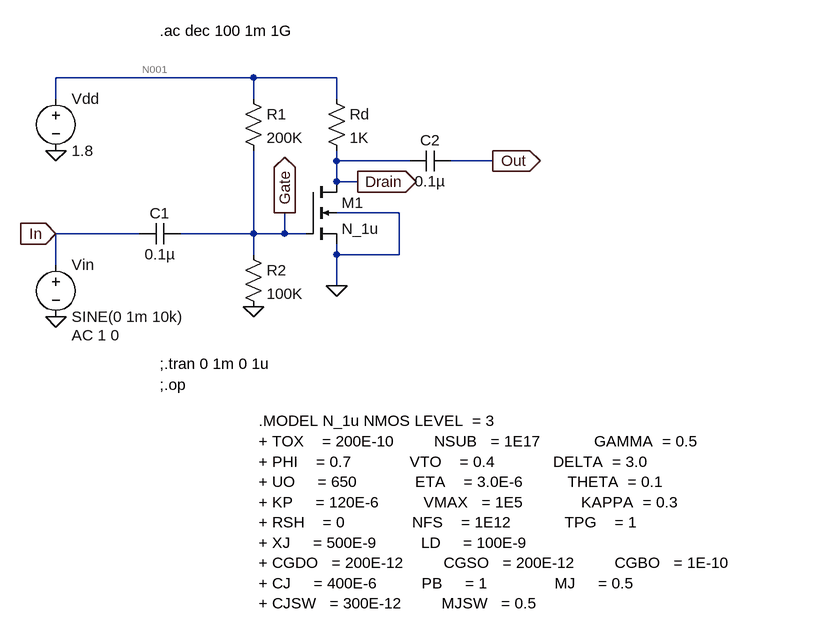
[diagram p0: schematic CS Amp.asc]
CS Amp.asc, the LTspice schematic file:
Version 4
SHEET 1 880 732
WIRE 0 -64 -304 -64
WIRE 128 -64 0 -64
WIRE -304 -32 -304 -64
WIRE 0 -32 0 -64
WIRE 128 -32 128 -64
WIRE 128 64 128 48
WIRE 240 64 128 64
WIRE 368 64 304 64
WIRE 128 96 128 64
WIRE 160 96 128 96
WIRE 224 144 128 144
WIRE -176 176 -304 176
WIRE 0 176 0 48
WIRE 0 176 -112 176
WIRE 48 176 48 144
WIRE 48 176 0 176
WIRE 80 176 48 176
WIRE 0 208 0 176
WIRE 128 208 128 192
WIRE 224 208 224 144
WIRE 224 208 128 208
WIRE -304 224 -304 176
WIRE 128 256 128 208
FLAG 0 288 0
FLAG -304 48 0
FLAG -304 304 0
FLAG 368 64 Out
IOPIN 368 64 Out
FLAG 160 96 Drain
IOPIN 160 96 Out
FLAG 48 144 Gate
IOPIN 48 144 Out
FLAG 128 256 0
FLAG -304 176 In
IOPIN -304 176 In
SYMBOL res 112 -48 R0
SYMATTR InstName Rd
SYMATTR Value 1K
SYMBOL nmos4 80 96 R0
SYMATTR InstName M1
SYMATTR Value N_1u
SYMATTR Value2 l=1u w=416u
SYMBOL res -16 -48 R0
SYMATTR InstName R1
SYMATTR Value 200K
SYMBOL res -16 192 R0
SYMATTR InstName R2
SYMATTR Value 100K
SYMBOL voltage -304 208 R0
WINDOW 123 24 124 Left 2
WINDOW 39 0 0 Left 0
SYMATTR Value2 AC 1 0
SYMATTR InstName Vin
SYMATTR Value SINE(0 1m 10k)
SYMBOL voltage -304 -48 R0
WINDOW 123 0 0 Left 0
WINDOW 39 0 0 Left 0
SYMATTR InstName Vdd
SYMATTR Value 1.8
SYMBOL cap 304 48 R90
WINDOW 0 0 32 VBottom 2
WINDOW 3 32 32 VTop 2
SYMATTR InstName C2
SYMATTR Value 0.1µ
SYMBOL cap -112 160 R90
WINDOW 0 0 32 VBottom 2
WINDOW 3 32 32 VTop 2
SYMATTR InstName C1
SYMATTR Value 0.1µ
TEXT -144 408 Left 2 !;.op
TEXT -144 376 Left 2 !;.tran 0 1m 0 1u
TEXT -144 -136 Left 2 !.ac dec 100 1m 1G
TEXT 8 464 Left 2 !.MODEL N_1u NMOS LEVEL  = 3                  \n+ TOX    = 200E-10         NSUB   = 1E17            GAMMA  = 0.5          \n+ PHI    = 0.7             VTO    = 0.4             DELTA  = 3.0         \n+ UO     = 650             ETA    = 3.0E-6          THETA  = 0.1          \n+ KP     = 120E-6          VMAX   = 1E5             KAPPA  = 0.3                \n+ RSH    = 0               NFS    = 1E12            TPG    = 1                  \n+ XJ     = 500E-9          LD     = 100E-9                 \n+ CGDO   = 200E-12         CGSO   = 200E-12         CGBO   = 1E-10              \n+ CJ     = 400E-6          PB     = 1               MJ     = 0.5           \n+ CJSW   = 300E-12         MJSW   = 0.5

The netlist it stands for:
* CS Amp.asc
Rd N001 Drain 1K
M1 Drain Gate 0 0 N_1u l=1u w=416u
R1 N001 Gate 200K
R2 Gate 0 100K
Vin In 0 SINE(0 1m 10k) AC 1 0
Vdd N001 0 1.8
C2 Out Drain 0.1µ
C1 Gate In 0.1µ
.model NMOS NMOS
.model PMOS PMOS
.lib standard.mos
;.op
;.tran 0 1m 0 1u
.ac dec 100 1m 1G
.MODEL N_1u NMOS LEVEL  = 3
+ TOX    = 200E-10         NSUB   = 1E17            GAMMA  = 0.5
+ PHI    = 0.7             VTO    = 0.4             DELTA  = 3.0
+ UO     = 650             ETA    = 3.0E-6          THETA  = 0.1
+ KP     = 120E-6          VMAX   = 1E5             KAPPA  = 0.3
+ RSH    = 0               NFS    = 1E12            TPG    = 1
+ XJ     = 500E-9          LD     = 100E-9
+ CGDO   = 200E-12         CGSO   = 200E-12         CGBO   = 1E-10
+ CJ     = 400E-6          PB     = 1               MJ     = 0.5
+ CJSW   = 300E-12         MJSW   = 0.5
.backanno
.end

* Results of the author's LTspice run, read from the files saved beside the schematic
* Operating Point, zero values left out:
*   V(n001) = 1.8 V
*   V(drain) = 299.9 mV
*   V(gate) = 600 mV
*   V(out) = 29.99 nV
*   Id(M1) = 1.5 mA
*   Is(M1) = -1.5 mA
*   I(R2) = 6 µA
*   I(R1) = 6 µA
*   I(Rd) = 1.5 mA
*   I(Vdd) = -1.506 mA
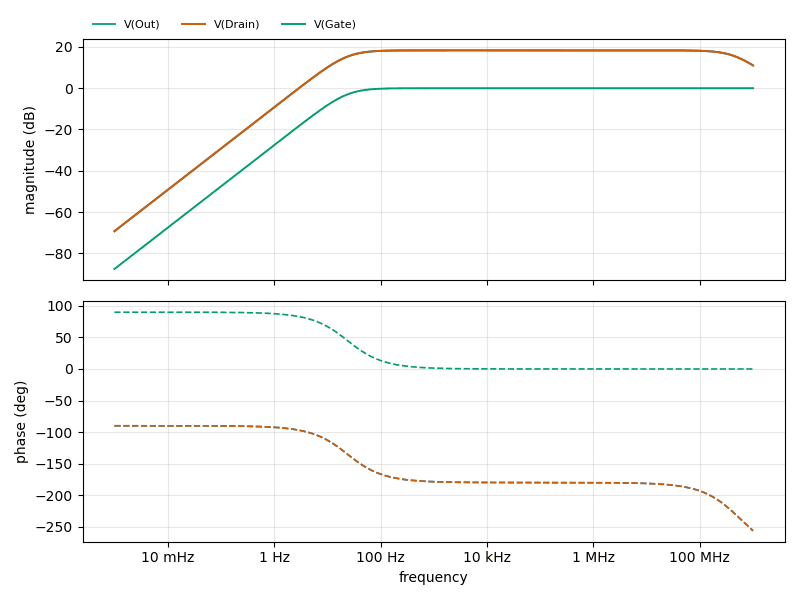
[diagram p1: AC Analysis of CS Amp.asc, plotted from the saved traces]
* AC Analysis, 1 run:
*   V(Out): -69.24 dB at 1 mHz, 11.03 dB at 1 GHz, peak 18.32 dB at 104.7 kHz, 3 dB below the peak at 23.87 Hz and 471.7 MHz
*   V(Drain): -69.24 dB at 1 mHz, 11.03 dB at 1 GHz, peak 18.32 dB at 104.7 kHz, 3 dB below the peak at 23.87 Hz and 471.7 MHz
*   V(Gate): -87.56 dB at 1 mHz, -0.00 dB at 1 GHz, peak -0.00 dB at 1 GHz, 3 dB below the peak at 23.87 Hz